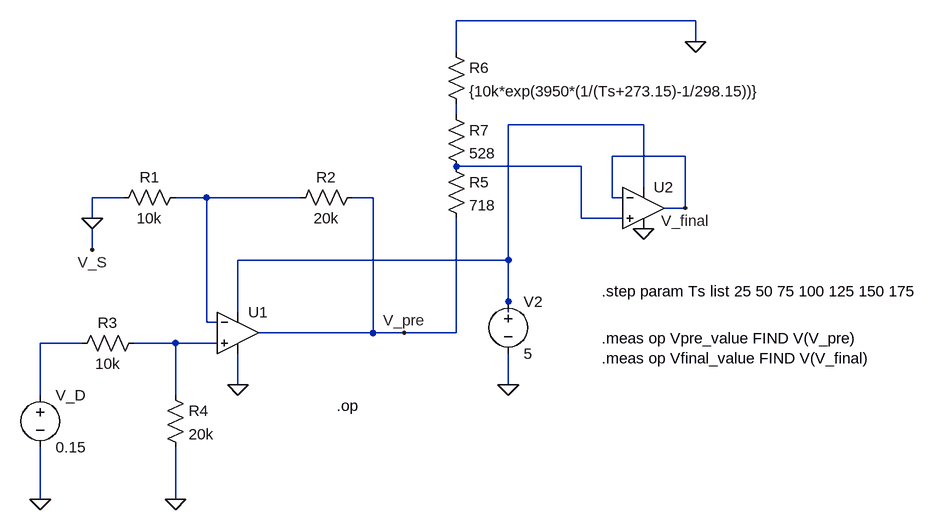
[diagram p0: schematic compensated_system.asc]
compensated_system.asc, the LTspice schematic file:
Version 4
SHEET 1 1424 784
WIRE 1040 -96 672 -96
WIRE 1040 -64 1040 -96
WIRE 672 -48 672 -96
WIRE 672 48 672 32
WIRE 960 64 752 64
WIRE 1024 112 912 112
WIRE 864 128 672 128
WIRE 960 160 960 64
WIRE 160 176 112 176
WIRE 288 176 240 176
WIRE 432 176 288 176
WIRE 544 176 512 176
WIRE 912 176 912 112
WIRE 928 176 912 176
WIRE 1024 192 1024 112
WIRE 1024 192 992 192
WIRE 112 208 112 176
WIRE 864 208 864 128
WIRE 928 208 864 208
WIRE 112 256 112 224
WIRE 752 272 752 64
WIRE 752 272 336 272
WIRE 752 336 752 272
WIRE 336 352 336 272
WIRE 752 352 752 336
WIRE 288 368 288 176
WIRE 304 368 288 368
WIRE 544 384 544 176
WIRE 544 384 368 384
WIRE 592 384 544 384
WIRE 672 384 672 208
WIRE 672 384 592 384
WIRE 96 400 32 400
WIRE 240 400 176 400
WIRE 304 400 240 400
WIRE 336 464 336 416
WIRE 752 464 752 416
WIRE 32 480 32 400
WIRE 240 480 240 400
WIRE 32 640 32 560
WIRE 240 640 240 560
FLAG 32 640 0
FLAG 240 640 0
FLAG 336 464 0
FLAG 112 208 0
FLAG 112 256 V_S
FLAG 592 384 V_pre
FLAG 752 464 0
FLAG 1040 -64 0
FLAG 1024 192 V_final
FLAG 960 224 0
SYMBOL OpAmps\\UniversalOpAmp2 336 384 R0
SYMATTR InstName U1
SYMBOL res 256 160 R90
WINDOW 0 0 56 VBottom 2
WINDOW 3 32 56 VTop 2
SYMATTR InstName R1
SYMATTR Value 10k
SYMBOL res 528 160 R90
WINDOW 0 0 56 VBottom 2
WINDOW 3 32 56 VTop 2
SYMATTR InstName R2
SYMATTR Value 20k
SYMBOL res 80 416 R270
WINDOW 0 32 56 VTop 2
WINDOW 3 0 56 VBottom 2
SYMATTR InstName R3
SYMATTR Value 10k
SYMBOL res 224 464 R0
SYMATTR InstName R4
SYMATTR Value 20k
SYMBOL voltage 32 464 R0
WINDOW 123 0 0 Left 0
WINDOW 39 0 0 Left 0
SYMATTR InstName V_D
SYMATTR Value 0.15
SYMBOL voltage 752 320 R0
WINDOW 123 0 0 Left 0
WINDOW 39 0 0 Left 0
SYMATTR InstName V2
SYMATTR Value 5
SYMBOL res 656 112 R0
SYMATTR InstName R5
SYMATTR Value 718
SYMBOL res 656 -64 R0
SYMATTR InstName R6
SYMATTR Value {10k*exp(3950*(1/(Ts+273.15)-1/298.15))}
SYMBOL res 656 32 R0
SYMATTR InstName R7
SYMATTR Value 528
SYMBOL OpAmps\\UniversalOpAmp2 960 192 R0
SYMATTR InstName U2
TEXT 488 496 Left 2 !.op
TEXT 896 320 Left 2 !.step param Ts list 25 50 75 100 125 150 175
TEXT 896 392 Left 2 !.meas op Vpre_value FIND V(V_pre)\n.meas op Vfinal_value FIND V(V_final)

The netlist it stands for:
* compensated_system.asc
XU1 N006 N004 N002 0 V_pre level2 Avol=1Meg GBW=10Meg Slew=10Meg Ilimit=25m Rail=0 Vos=0 En=0 Enk=0 In=0 Ink=0 Rin=500Meg  ; pins In+ In- V+ V- OUT
R1 N004 0 10k
R2 V_pre N004 20k
R3 N005 N006 10k
R4 N006 0 20k
V_D N005 0 0.15
V2 N002 0 5
R5 N003 V_pre 718
R6 0 N001 {10k*exp(3950*(1/(Ts+273.15)-1/298.15))}
R7 N001 N003 528
XU2 N003 V_final N002 0 V_final level2 Avol=1Meg GBW=10Meg Slew=10Meg Ilimit=25m Rail=0 Vos=0 En=0 Enk=0 In=0 Ink=0 Rin=500Meg  ; pins In+ In- V+ V- OUT
.op
.step param Ts list 25 50 75 100 125 150 175
.meas op Vpre_value FIND V(V_pre)
.meas op Vfinal_value FIND V(V_final)
.lib UniversalOpAmp2.lib
.backanno
.end